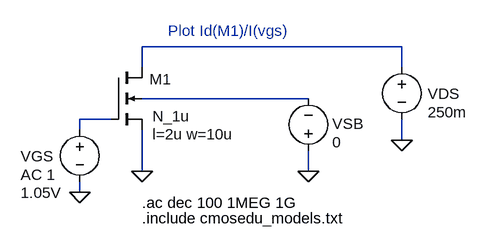
[diagram p0: schematic Tab9_1_ftn.asc]
Tab9_1_ftn.asc, the LTspice schematic file:
Version 4
SHEET 1 1128 680
WIRE 848 80 448 80
WIRE 448 112 448 80
WIRE 848 112 848 80
WIRE 704 160 448 160
WIRE 400 192 352 192
WIRE 352 208 352 192
WIRE 848 224 848 192
WIRE 448 272 448 208
WIRE 704 272 704 240
WIRE 352 304 352 288
FLAG 352 304 0
FLAG 448 272 0
FLAG 848 224 0
FLAG 704 272 0
SYMBOL nmos4 400 112 R0
WINDOW 0 59 18 Left 0
WINDOW 3 64 75 Left 0
WINDOW 123 64 103 Left 0
SYMATTR InstName M1
SYMATTR Value N_1u
SYMATTR Value2 l=2u w=10u
SYMBOL voltage 352 192 R0
WINDOW 0 -91 57 Left 0
WINDOW 3 -91 113 Left 0
WINDOW 123 -91 85 Left 0
WINDOW 39 0 0 Left 0
SYMATTR InstName VGS
SYMATTR Value 1.05V
SYMATTR Value2 AC 1
SYMBOL voltage 848 96 R0
WINDOW 123 0 0 Left 0
WINDOW 39 0 0 Left 0
WINDOW 0 40 57 Left 0
WINDOW 3 40 85 Left 0
SYMATTR InstName VDS
SYMATTR Value 250m
SYMBOL voltage 704 256 R180
WINDOW 0 -37 57 Right 0
WINDOW 3 -37 29 Right 0
WINDOW 123 0 0 Left 0
WINDOW 39 0 0 Left 0
SYMATTR InstName VSB
SYMATTR Value 0
TEXT 448 320 Left 0 !.ac dec 100 1MEG 1G
TEXT 448 344 Left 0 !.include cmosedu_models.txt
TEXT 488 56 Left 0 ;Plot Id(M1)/I(vgs)

The netlist it stands for:
* Tab9_1_ftn.asc
M1 N001 N003 0 N002 N_1u l=2u w=10u
VGS N003 0 1.05V AC 1
VDS N001 0 250m
VSB 0 N002 0
.model NMOS NMOS
.model PMOS PMOS
.lib standard.mos
.ac dec 100 1MEG 1G
.include cmosedu_models.txt
* Plot Id(M1)/I(vgs)
.backanno
.end